# Altium schematic sheet Controller.SchDoc: Wake on LAN Hardware Design
size A4; Author: Severin Sprenger; DrawnBy: Severin Sprenger; DocumentNumber: 18032023; Revision: 1; SheetNumber: 1; SheetTotal: 2
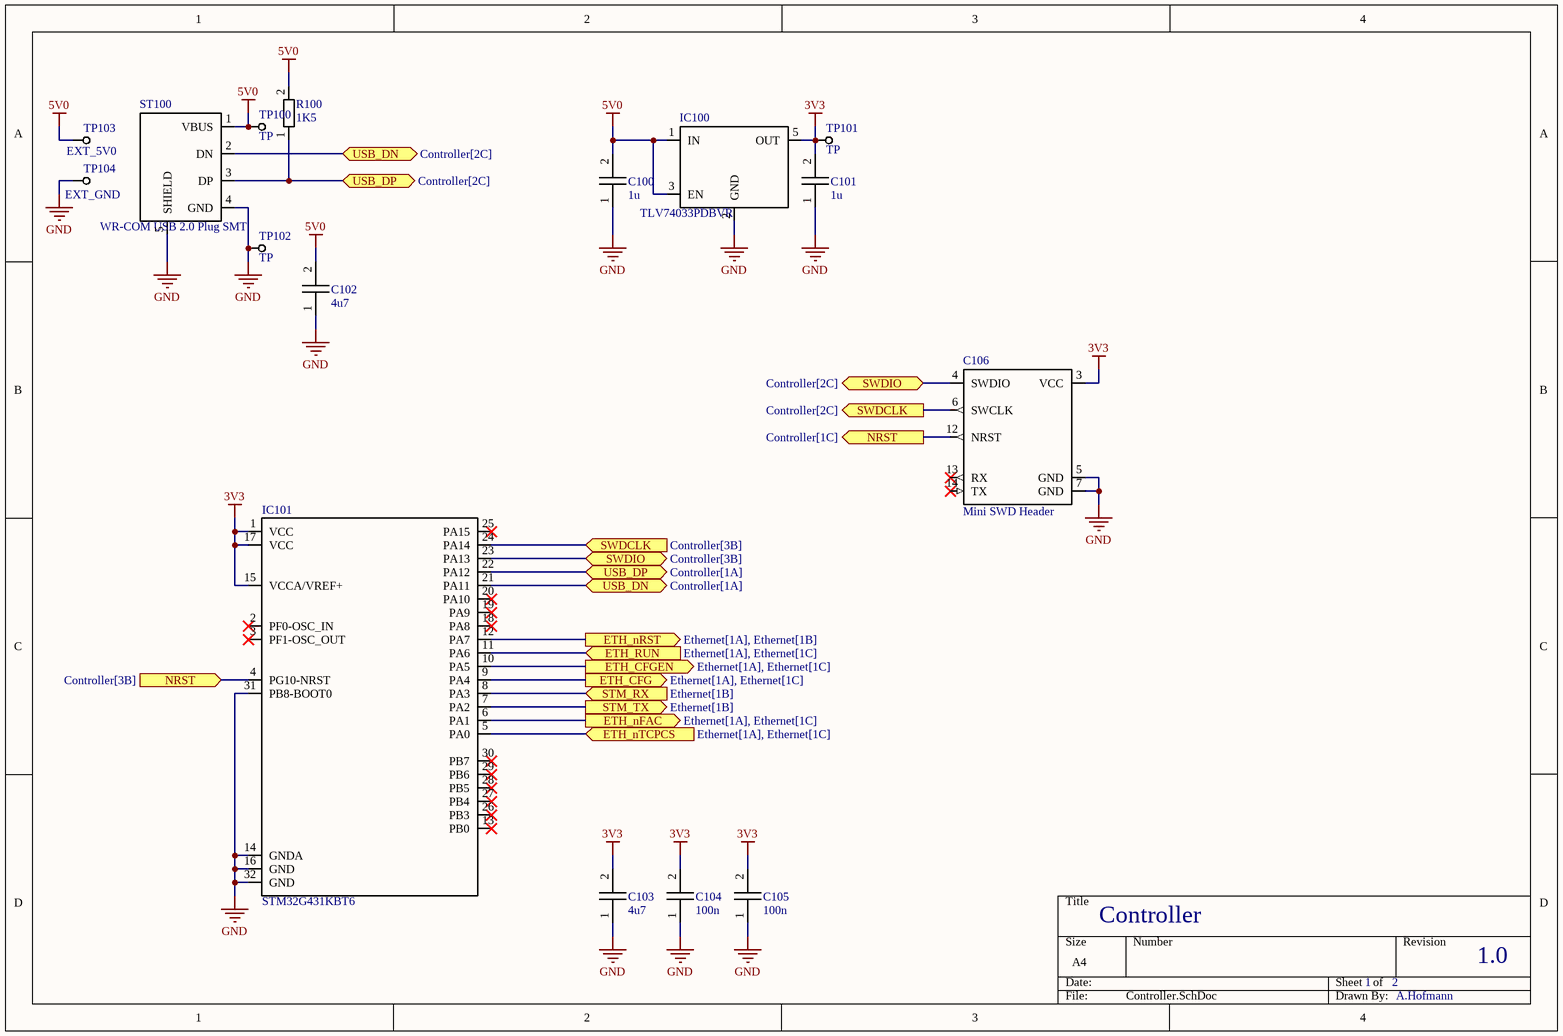
[diagram p0: Controller.SchDoc]

## Parts
C100  1u  [C_0402]
C101  1u  [C_0402]
C102  4u7  [C_0603]
C103  4u7  [C_0603]
C104  100n  [C_0402]
C105  100n  [C_0402]
C106  Mini SWD Header  [Mini SWD Header]
IC100  TLV74033PDBVR  [SOT-23]
IC101  STM32G431KBT6  [LQFP32]
R100  1K5  [R_0402]
ST100  WR-COM USB 2.0 Plug SMT  [629004113921]
TP100  TP  [STP_0.5mm]
TP101  TP  [STP_0.5mm]
TP102  TP  [STP_0.5mm]
TP103  EXT_5V0  [TTP_1mm]
TP104  EXT_GND  [TTP_1mm]

## Ports
ETH_CFG (out, see Ethernet[1A], Ethernet[1C]), ETH_CFGEN (out, see Ethernet[1A], Ethernet[1C]), ETH_nFAC (out, see Ethernet[1A], Ethernet[1C]), ETH_nRST (out, see Ethernet[1A], Ethernet[1B]), ETH_nTCPCS (in, see Ethernet[1A], Ethernet[1C]), ETH_RUN (in, see Ethernet[1A], Ethernet[1C]), NRST (in, see Controller[3B]), NRST (out, see Controller[1C]), STM_RX (in, see Ethernet[1B]), STM_TX (out, see Ethernet[1B]), SWDCLK (in, see Controller[3B]), SWDCLK (out, see Controller[2C]), SWDIO (bidir, see Controller[2C]), SWDIO (bidir, see Controller[3B]), USB_DN (bidir, see Controller[1A]), USB_DN (bidir, see Controller[2C]), USB_DP (bidir, see Controller[1A]), USB_DP (bidir, see Controller[2C])

## Nets
3V3: C101.2 C103.2 C104.2 C105.2 C106.3(VCC) IC100.5(OUT) IC101.1(VCC) IC101.15(VCCA/VREF+) IC101.17(VCC) TP101.1
5V0: C100.2 C102.2 IC100.1(IN) IC100.3(EN) R100.2 ST100.1(VBUS) TP100.1 TP103.1
GND: C100.1 C101.1 C102.1 C103.1 C104.1 C105.1 C106.5(GND) C106.7(GND) IC100.2(GND) IC101.14(GNDA) IC101.16(GND) IC101.31(PB8-BOOT0) IC101.32(GND) ST100.4(GND) ST100.5(SHIELD) TP102.1 TP104.1
ETH_CFG: IC101.9(PA4) ; port ETH_CFG
ETH_CFGEN: IC101.10(PA5) ; port ETH_CFGEN
ETH_nFAC: IC101.6(PA1) ; port ETH_nFAC
ETH_nRST: IC101.12(PA7) ; port ETH_nRST
ETH_nTCPCS: IC101.5(PA0) ; port ETH_nTCPCS
ETH_RUN: IC101.11(PA6) ; port ETH_RUN
NRST: C106.12(NRST) IC101.4(PG10-NRST) ; port NRST
STM_RX: IC101.8(PA3) ; port STM_RX
STM_TX: IC101.7(PA2) ; port STM_TX
SWDCLK: C106.6(SWCLK) IC101.24(PA14) ; port SWDCLK
SWDIO: C106.4(SWDIO) IC101.23(PA13) ; port SWDIO
USB_DN: IC101.21(PA11) ST100.2(DN) ; port USB_DN
USB_DP: IC101.22(PA12) R100.1 ST100.3(DP) ; port USB_DP

Not connected (* = marked no-connect by the designer): C106 13(RX)* 14(TX)*; IC101 2(PF0-OSC_IN)* 3(PF1-OSC_OUT)* 13(PB0)* 18(PA8)* 19(PA9)* 20(PA10)* 25(PA15)* 26(PB3)* 27(PB4)* 28(PB5)* 29(PB6)* 30(PB7)*

## Notes on the sheet
- Controller
- 1
- 2
- 1.0
- A.Hofmann

## Library data of the parts
C100-C105 = CeCa
C106 = Mini SWD Header: Manufacturer Nr.: 3220-14-0300-00
IC100 = TLV74033PDBVR: Linear Voltage Regulator IC Positive Fixed 1 Output 300mA SOT-23-5; ComponentLink1Description: New link; ComponentLink1URL: https://www.ti.com/lit/ds/symlink/tlv740p.pdf?ts=1680939934820
IC101 = STM32G431KBT6: ARM Microcontrollers - MCU Mainstream Arm Cortex-M4 MCU 170 MHz 128 Kbytes of Flash Math Accel, Medium Anal; ComponentLink1Description: Datasheet; ComponentLink1URL: https://www.st.com/resource/en/datasheet/stm32g431kb.pdf
R100 = Res
ST100 = WR-COM USB 2.0 Plug SMT: CONN PLUG USB2.0 TYPEA 4P SMD RA; ComponentLink1Description: New link; ComponentLink1URL: https://www.we-online.com/components/products/datasheet/629004113921.pdf
TP103 TP104 = TP